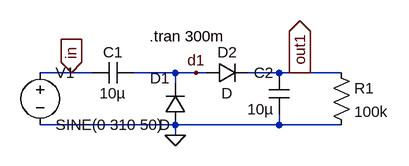
[diagram p0: schematic doubleur_diode_sw.asc]
doubleur_diode_sw.asc, the LTspice schematic file:
Version 4
SHEET 1 880 732
WIRE -64 192 -112 192
WIRE -32 192 -64 192
WIRE 96 192 32 192
WIRE 128 192 96 192
WIRE 144 192 128 192
WIRE 256 192 208 192
WIRE 288 192 256 192
WIRE 352 192 288 192
WIRE 96 208 96 192
WIRE 96 272 96 256
WIRE 96 272 -112 272
WIRE 256 272 256 256
WIRE 256 272 96 272
WIRE 352 272 256 272
WIRE 96 288 96 272
FLAG 96 288 0
FLAG -64 192 in
IOPIN -64 192 In
FLAG 128 192 d1
FLAG 288 192 out1
IOPIN 288 192 Out
SYMBOL diode 112 272 R180
WINDOW 0 24 72 Left 0
WINDOW 3 24 0 Left 0
SYMATTR InstName D1
SYMBOL cap 32 176 R90
WINDOW 0 0 32 VBottom 0
WINDOW 3 32 32 VTop 0
SYMATTR InstName C1
SYMATTR Value 10µ
SYMBOL diode 144 208 R270
WINDOW 0 32 32 VTop 0
WINDOW 3 0 32 VBottom 0
SYMATTR InstName D2
SYMBOL cap 272 256 R180
WINDOW 0 24 64 Left 0
WINDOW 3 24 8 Left 0
SYMATTR InstName C2
SYMATTR Value 10µ
SYMBOL voltage -112 176 R0
WINDOW 123 0 0 Left 0
WINDOW 39 0 0 Left 0
SYMATTR InstName V1
SYMATTR Value SINE(0 310 50)
SYMBOL res 336 176 R0
SYMATTR InstName R1
SYMATTR Value 100k
TEXT 56 136 Left 0 !.tran 300m

The netlist it stands for:
* doubleur_diode_sw.asc
D1 0 d1 D
C1 d1 in 10µ
D2 d1 out1 D
C2 0 out1 10µ
V1 in 0 SINE(0 310 50)
R1 out1 0 100k
.model D D
.lib standard.dio
.tran 300m
.backanno
.end